# EAGLE design vcf (EAGLE 7.5.0)
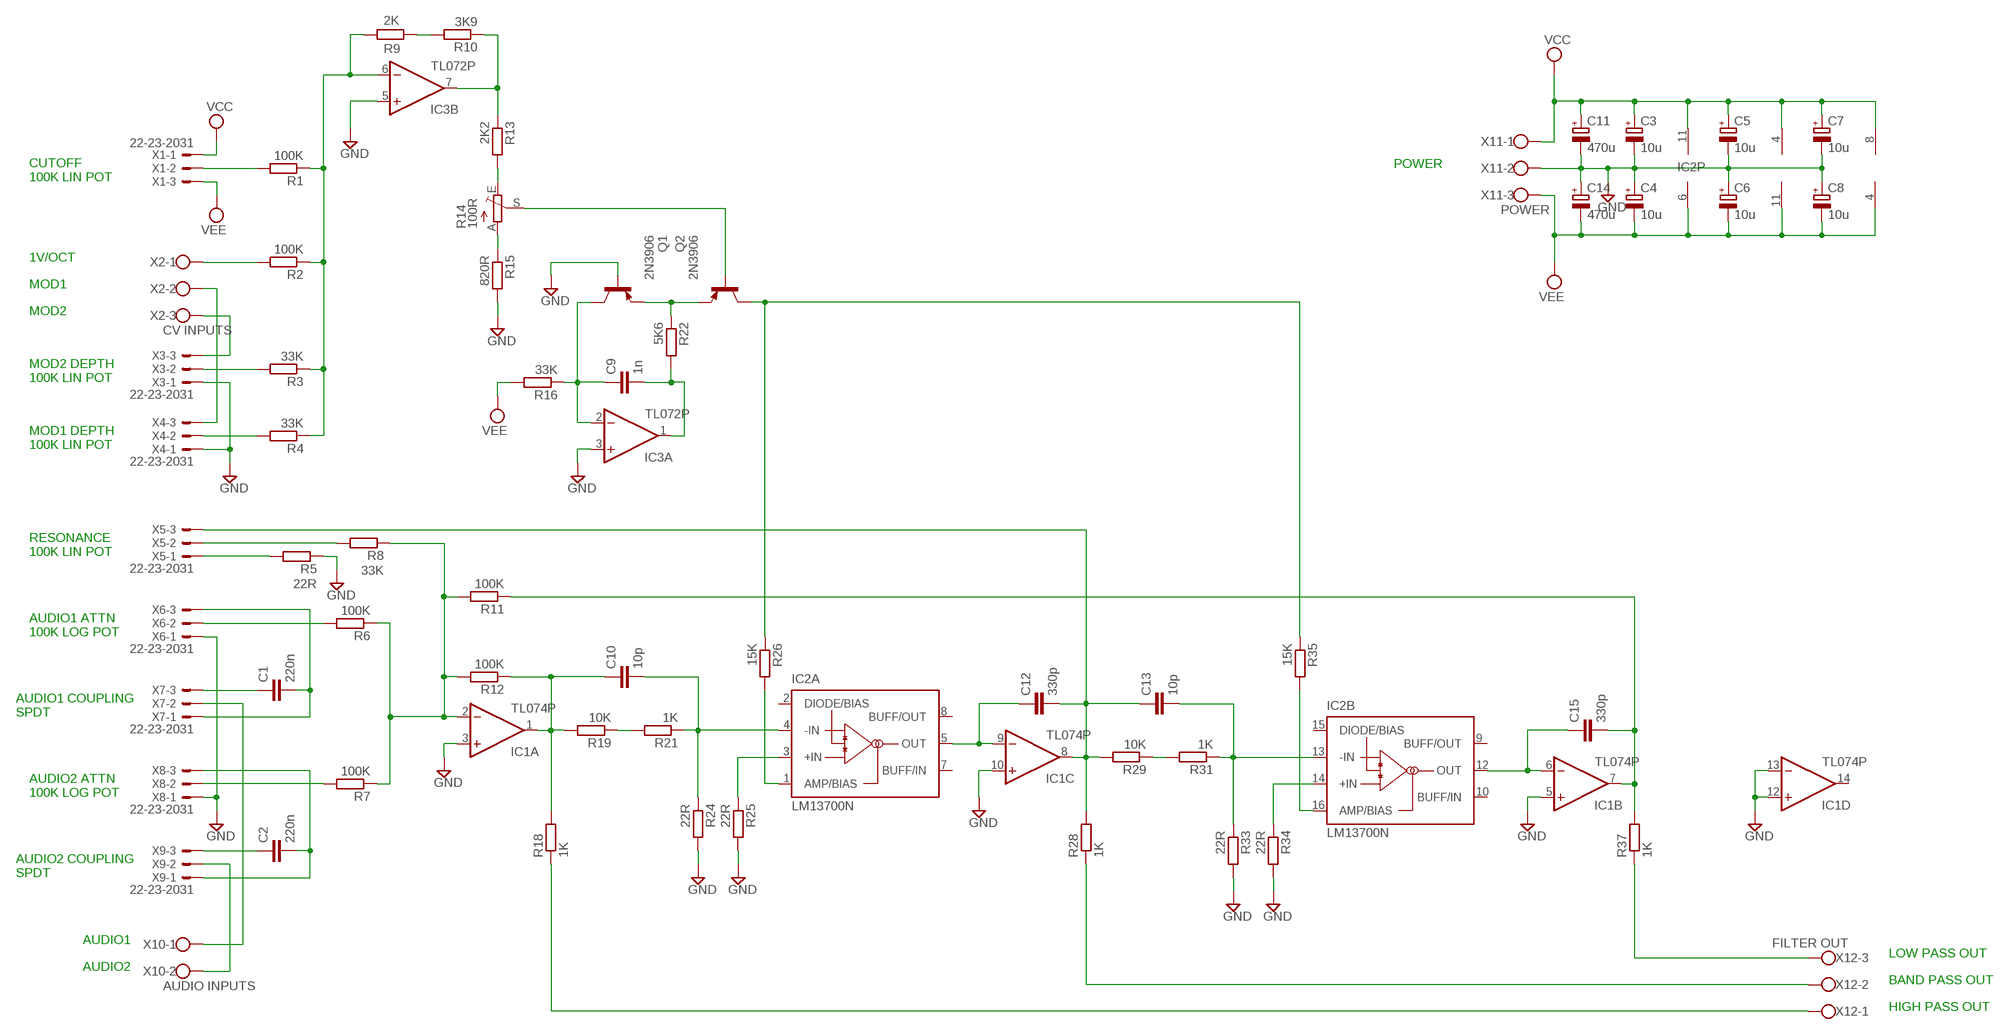
[diagram p0: schematic, sheet 1]

## Parts
C1  220n  C-EU025-025X050  [C025-025X050]
C2  220n  C-EU025-025X050  [C025-025X050]
C3  10u  CPOL-EUE1.8-4  [E1,8-4]
C4  10u  CPOL-EUE1.8-4  [E1,8-4]
C5  10u  CPOL-EUE1.8-4  [E1,8-4]
C6  10u  CPOL-EUE1.8-4  [E1,8-4]
C7  10u  CPOL-EUE1.8-4  [E1,8-4]
C8  10u  CPOL-EUE1.8-4  [E1,8-4]
C9  1n  C-EU025-024X044  [C025-024X044]
C10  10p  C-EU025-024X044  [C025-024X044]
C11  470u  CPOL-EUE2.5-6  [E2,5-6]
C12  330p  C-EU025-024X044  [C025-024X044]
C13  10p  C-EU025-024X044  [C025-024X044]
C14  470u  CPOL-EUE2.5-6  [E2,5-6]
C15  330p  C-EU025-024X044  [C025-024X044]
IC1  TL074P  [DIL14]
IC2  LM13700N  LM13600N  [DIL16]
IC3  TL072P  [DIL08]
Q1  2N3906  [TO92]
Q2  2N3906  [TO92]
R1  100K  R-EU_0204/7  [0204/7]
R2  100K  R-EU_0204/7  [0204/7]
R3  33K  R-EU_0204/7  [0204/7]
R4  33K  R-EU_0204/7  [0204/7]
R5  22R  R-EU_0204/7  [0204/7]
R6  100K  R-EU_0204/7  [0204/7]
R7  100K  R-EU_0204/7  [0204/7]
R8  33K  R-EU_0204/7  [0204/7]
R9  2K  R-EU_0309/12  [0309/12]
R10  3K9  R-EU_0204/7  [0204/7]
R11  100K  R-EU_0204/7  [0204/7]
R12  100K  R-EU_0204/7  [0204/7]
R13  2K2  R-EU_0204/7  [0204/7]
R14  100R  TRIM_EU-CA6V  [CA6V]
R15  820R  R-EU_0204/7  [0204/7]
R16  33K  R-EU_0204/7  [0204/7]
R18  1K  R-EU_0204/7  [0204/7]
R19  10K  R-EU_0204/7  [0204/7]
R21  1K  R-EU_0204/7  [0204/7]
R22  5K6  R-EU_0204/7  [0204/7]
R24  22R  R-EU_0204/7  [0204/7]
R25  22R  R-EU_0204/7  [0204/7]
R26  15K  R-EU_0204/7  [0204/7]
R28  1K  R-EU_0204/7  [0204/7]
R29  10K  R-EU_0204/7  [0204/7]
R31  1K  R-EU_0204/7  [0204/7]
R33  22R  R-EU_0204/7  [0204/7]
R34  22R  R-EU_0204/7  [0204/7]
R35  15K  R-EU_0204/7  [0204/7]
R37  1K  R-EU_0204/7  [0204/7]
X1  22-23-2031  [22-23-2031]
X2  CV INPUTS  W237-103  [W237-103]
X3  22-23-2031  [22-23-2031]
X4  22-23-2031  [22-23-2031]
X5  22-23-2031  [22-23-2031]
X6  22-23-2031  [22-23-2031]
X7  22-23-2031  [22-23-2031]
X8  22-23-2031  [22-23-2031]
X9  22-23-2031  [22-23-2031]
X10  AUDIO INPUTS  W237-102  [W237-102]
X11  POWER  W237-103  [W237-103]
X12  FILTER OUT  W237-103  [W237-103]

## Nets
GND: C3.- C4.+ C5.- C6.+ C7.- C8.+ C11.- C14.+ IC1.3(A:+IN) IC1.5(B:+IN) IC1.10(C:+IN) IC1.12(D:+IN) IC1.13(D:-IN) IC3.3(A:+IN) IC3.5(B:+IN) Q1.2(B) R5.1 R15.2 R24.2 R25.2 R33.2 R34.2 X3.1 X4.1 X6.1 X8.1 X11.2
N$1: X7.2 X10.1
N$1V-OCT: R2.2 X2.1
N$2: X2.3 X3.3
N$3: X2.2 X4.3
N$4: R3.2 X3.2
N$5: R4.2 X4.2
N$7: R1.2 X1.2
N$8: R9.2 R10.2
N$9: IC3.7(B:OUT) R10.1 R13.1
N$10: R13.2 R14.E
N$11: R14.A R15.1
N$12: Q1.3(E) Q2.3(E) R22.1
N$13: Q2.2(B) R14.S
N$14: C9.2 IC3.1(A:OUT) R22.2
N$15: C9.1 IC3.2(A:-IN) Q1.1(C) R16.1
N$16: X9.2 X10.2
N$17: C1.1 X7.3
N$18: C2.1 X9.3
N$19: C1.2 X6.3 X7.1
N$20: C2.2 X8.3 X9.1
N$21: R6.2 X6.2
N$22: R7.2 X8.2
N$23: C10.1 IC1.1(A:OUT) R12.1 R18.2 R19.2
N$24: R19.1 R21.2
N$25: C10.2 IC2.4(A:-IN) R21.1 R24.1
N$26: IC2.3(A:+IN) R25.1
N$27: IC2.1(A:AMP/BIAS) R26.2
N$28: IC1.2(A:-IN) R6.1 R7.1 R8.1 R11.2 R12.2
N$29: C12.1 IC1.9(C:-IN) IC2.5(A:OUT)
N$30: R29.1 R31.2
N$32: C13.2 IC2.13(B:-IN) R31.1 R33.1
N$33: R5.2 X5.1
N$34: IC2.14(B:+IN) R34.1
N$35: IC2.16(B:AMP/BIAS) R35.2
N$36: Q2.1(C) R26.1 R35.1
N$37: C15.1 IC1.6(B:-IN) IC2.12(B:OUT)
N$38: R8.2 X5.2
N$39: C12.2 C13.1 IC1.8(C:OUT) R28.2 R29.2 X5.3
N$47: C15.2 IC1.7(B:OUT) R11.1 R37.2
N$BP-OUT: R28.1 X12.2
N$EXP-CV: IC3.6(B:-IN) R1.1 R2.1 R3.1 R4.1 R9.1
N$HP-OUT: R18.1 X12.1
N$LP-OUT: R37.1 X12.3
VCC: C3.+ C5.+ C7.+ C11.+ IC1.4(P:V+) IC2.11(P:V+) IC3.8(P:V+) X1.1 X11.1
VEE: C4.- C6.- C8.- C14.- IC1.11(P:V-) IC2.6(P:V-) IC3.4(P:V-) R16.2 X1.3 X11.3
Unconnected: IC1.14(D:OUT) IC2.2(A:DIODE/BIAS) IC2.7(A:BUFF/IN) IC2.8(A:BUFF/OUT) IC2.9(B:BUFF/OUT) IC2.10(B:BUFF/IN) IC2.15(B:DIODE/BIAS)

## Notes on the sheet
- POWER
- CUTOFF
  100K LIN POT
- 1V/OCT
- MOD1
- MOD2
- MOD2 DEPTH
  100K LIN POT
- MOD1 DEPTH
  100K LIN POT
- RESONANCE
  100K LIN POT
- AUDIO1 ATTN
  100K LOG POT
- AUDIO1 COUPLING
  SPDT
- AUDIO2 ATTN
  100K LOG POT
- AUDIO2 COUPLING
  SPDT
- AUDIO1
- LOW PASS OUT
- AUDIO2
- BAND PASS OUT
- HIGH PASS OUT

## Library data of the parts
C1 C2 C9 C10 C12 C13 C15 = rcl:C-EU: CAPACITOR, European symbol
C3-C8 C11 C14 = rcl:CPOL-EU: POLARIZED CAPACITOR, European symbol
IC1 = linear:TL074: OP AMP
IC2 = national-semiconductor:LM13600: Dual Operational Transconductance Amplifiers with Linearizing Diodes and Buffers Source: lm13600.PDF
IC3 = linear:TL072: OP AMP
Q1 Q2 = transistor-pnp:2N3906: PNP Transistor
R1-R13 R15 R16 R18 R19 R21 R22 R24-R26 R28 R29 R31 R33-R35 R37 = rcl:R-EU_: RESISTOR, European symbol
R14 = pot:TRIM_EU-: POTENTIOMETER
X1 X3-X9 = con-molex:22-23-2031: .100" (2.54mm) Center Header - 3 Pin; MF: MOLEX; MPN: 22-23-2031; OC_FARNELL: 1462950; OC_NEWARK: 30C0862
X2 X11 X12 = con-wago-500:W237-103: WAGO SCREW CLAMP; MPN: 237-103; OC_FARNELL: unknown; OC_NEWARK: 18M7116
X10 = con-wago-500:W237-102: WAGO SCREW CLAMP; MPN: 237-102; OC_FARNELL: unknown; OC_NEWARK: 70K9898

## Board
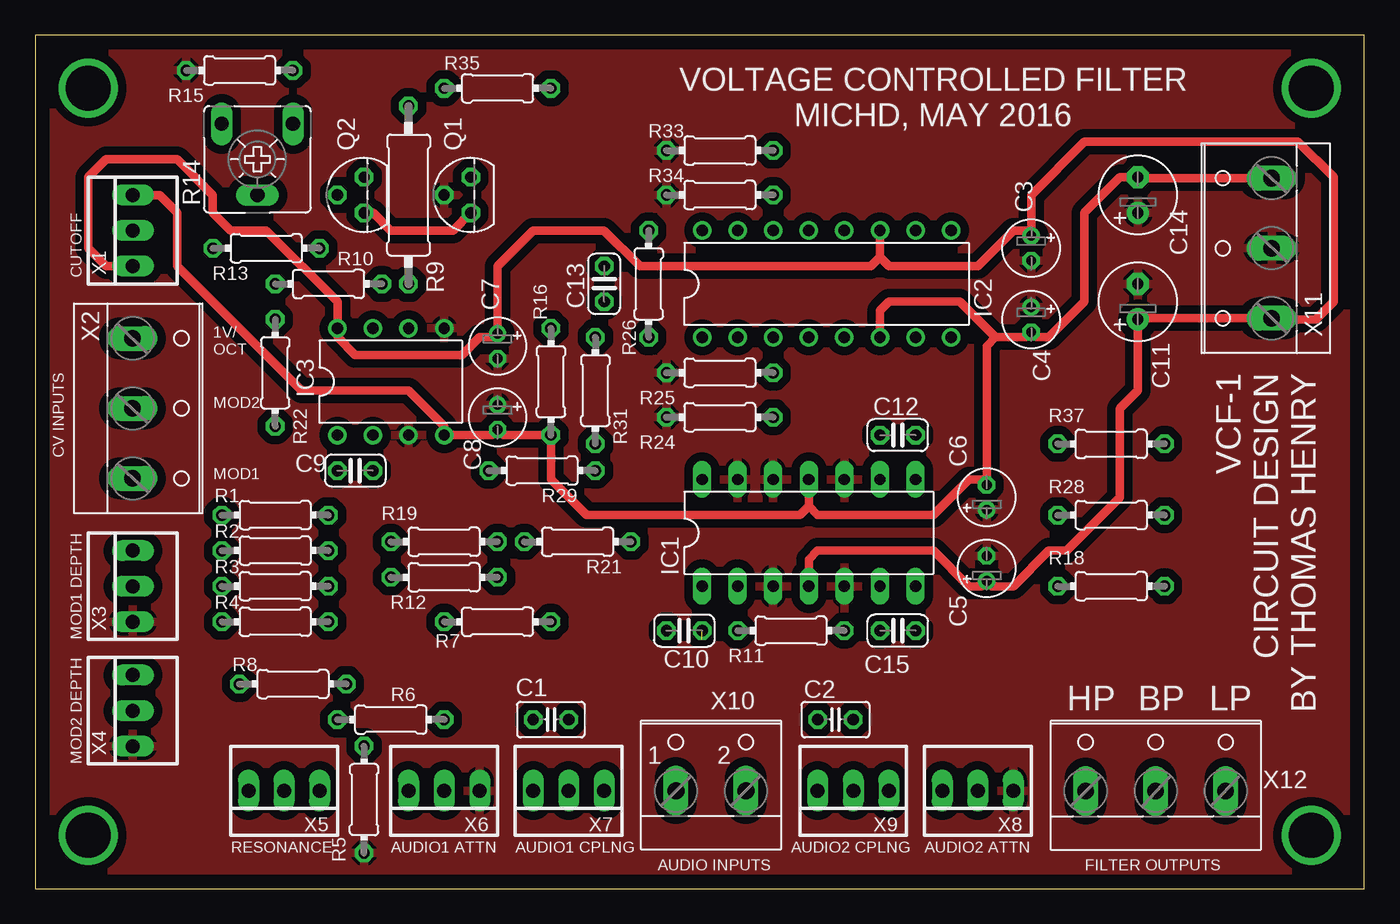
[diagram p1: board, top side]
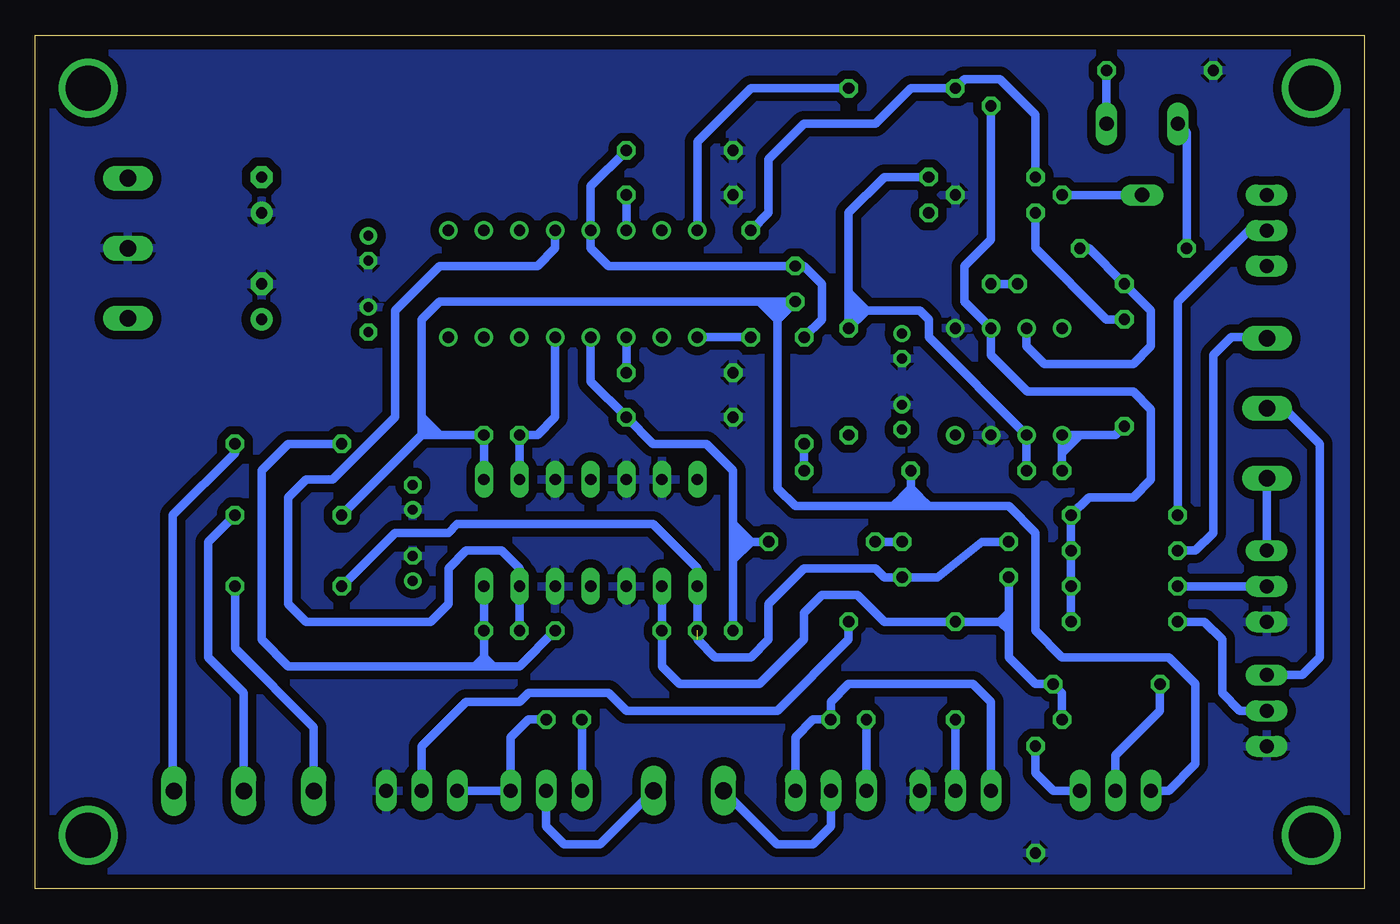
[diagram p2: board, bottom side, seen from below]

Size 94.92 x 60.95 mm. Coordinates in mm from the lower left corner, seen from the top.
Outline: 0,0 94.92,0 94.92,60.95 0,60.95 0,0
Copper layers (1*16): Top 0.035mm / dielectric 1.5mm / Bottom 0.035mm
Design rules "default": minimum track width 10mil, minimum drill 24mil, track to track 8mil, track to pad 8mil, pad to pad 8mil, via to via 8mil, smd to smd 8mil, copper to edge 40mil, drill to drill 8mil, minimum pad ring 10mil, minimum via ring 8mil, stop-mask expansion 4mil, vias tented up to drill 0mil, thermal gap 10mil

### Footprints (pad centres in the part's own frame; a part is rotated, then mirrored left to right if it is on the bottom)
C025-025X050 = drill 0.813 octagon: 1 -1.27,0; 2 1.27,0
E1,8-4 = drill 0.711 pad 1.168: + -0.889,0 | drill 0.711 pad 1.168 octagon: - 0.889,0
C025-024X044 = drill 0.813 octagon: 1 -1.27,0; 2 1.27,0
E2,5-6 = drill 0.813 pad 1.6: + -1.27,0 | drill 0.813 pad 1.6 octagon: - 1.27,0
DIL14 = drill 0.813 long: 1 -7.62,-3.81; 2 -5.08,-3.81; 3 -2.54,-3.81; 4 0,-3.81; 5 2.54,-3.81; 6 5.08,-3.81; 7 7.62,-3.81; 8 7.62,3.81; 9 5.08,3.81; 10 2.54,3.81; 11 0,3.81; 12 -2.54,3.81; 13 -5.08,3.81; 14 -7.62,3.81
DIL16 = drill 0.813 pad 1.27: 1 -8.89,-3.81; 2 -6.35,-3.81; 3 -3.81,-3.81; 4 -1.27,-3.81; 5 1.27,-3.81; 6 3.81,-3.81; 7 6.35,-3.81; 8 8.89,-3.81; 9 8.89,3.81; 10 6.35,3.81; 11 3.81,3.81; 12 1.27,3.81; 13 -1.27,3.81; 14 -3.81,3.81; 15 -6.35,3.81; 16 -8.89,3.81
DIL08 = drill 0.813 pad 1.27: 1 -3.81,-3.81; 2 -1.27,-3.81; 3 1.27,-3.81; 4 3.81,-3.81; 5 3.81,3.81; 6 1.27,3.81; 7 -1.27,3.81; 8 -3.81,3.81
TO92 = drill 0.813 octagon: 1 1.27,0; 2 0,1.905; 3 -1.27,0
0204/7 = drill 0.813 octagon: 1 -3.81,0; 2 3.81,0
0309/12 = drill 0.813 octagon: 1 -6.35,0; 2 6.35,0
CA6V = drill 1.016 long: A -2.54,-2.54; E 2.54,-2.54; S 0,2.54
22-23-2031 = drill 1 long: 1 -2.54,0; 2 0,0; 3 2.54,0
W237-103 = drill 1.194 long: 1 -5,-1.29; 2 0,-1.29; 3 5,-1.29
W237-102 = drill 1.194 long: 1 -2.5,-1.27; 2 2.5,-1.27

### Placement (x,y rotation side)
C1  36.83,12.06 0 top
C2  57.15,12.06 0 top
C3  71.12,45.72 270 top
C4  71.12,40.64 270 top
C5  67.94,22.86 90 top
C6  67.94,27.94 90 top
C7  33.02,38.73 270 top
C8  33.02,33.66 270 top
C9  22.86,29.84 180 top
C10  46.35,18.41 180 top
C11  78.74,41.91 90 top
C12  61.59,32.38 0 top
C13  40.64,43.18 90 top
C14  78.74,49.53 90 top
C15  61.59,18.41 0 top
IC1  55.24,25.4 0 top
IC2  56.52,43.18 0 top
IC3  25.4,36.2 0 top
Q1  31.11,49.53 90 top
Q2  23.5,49.53 90 top
R1  17.14,26.67 180 top
R2  17.14,24.13 180 top
R3  17.14,21.59 180 top
R4  17.14,19.05 180 top
R5  23.5,6.35 90 top
R6  25.4,12.06 0 top
R7  33.02,19.05 0 top
R8  18.41,14.61 180 top
R9  26.67,49.53 270 top
R10  20.95,43.18 0 top
R11  53.98,18.41 180 top
R12  29.21,22.23 180 top
R13  16.51,45.72 180 top
R14  15.88,52.07 180 top
R15  14.61,58.42 180 top
R16  36.83,36.2 270 top
R18  76.83,21.59 180 top
R19  29.21,24.77 180 top
R21  38.73,24.77 180 top
R22  17.14,36.83 270 top
R24  48.9,33.66 180 top
R25  48.9,36.83 180 top
R26  43.81,43.18 270 top
R28  76.83,26.67 180 top
R29  36.2,29.84 180 top
R31  40.01,35.56 270 top
R33  48.9,52.7 180 top
R34  48.9,49.53 180 top
R35  33.02,57.15 0 top
R37  76.83,31.75 180 top
X1  6.99,46.99 90 top
X2  8.26,34.29 270 top
X3  6.99,21.59 90 top
X4  6.99,12.7 90 top
X5  17.78,6.99 180 top
X6  29.21,6.99 180 top
X7  38.1,6.99 180 top
X8  67.31,6.99 180 top
X9  58.42,6.99 180 top
X10  48.26,8.26 0 top
X11  87,45.72 90 top
X12  80.01,8.26 0 top

### Tracks (layer width: path | path; a pad name or v marks a point on that pad's centre or on a via)
GND
  pour Top (isolate 0.61): 0.64,60.33 94.61,60.33 94.61,0.64 0.64,0.64
  pour Bottom (isolate 0.61): 0.64,60.33 94.61,60.33 94.61,0.64 0.64,0.64
N$1
  Bottom 0.61: X7.2 38.1,4.45 39.37,3.17 41.95,3.17 X10.1
N$1V-OCT
  Bottom 0.61: R2.2 12.06,24.13 10.79,25.4 10.79,38.1 9.53,39.37 7.04,39.37 X2.1
N$2
  Bottom 0.61: X3.3 6.99,28 X2.3
N$3
  Bottom 0.61: X2.2 5.71,34.29 3.17,31.75 3.17,16.51 4.45,15.24 X4.3
N$4
  Bottom 0.61: R3.2 X3.2
N$5
  Bottom 0.61: X4.2 8.89,12.7 10.16,13.97 10.16,17.78 11.43,19.05 R4.2
N$6  (via drill 3.2 pad 3.81)
  other vias: 3.81,3.81
N$7
  Bottom 0.61: R1.2 13.34,41.91 8.26,46.99 X1.2
N$8
  Bottom 0.61: R9.2 R10.2
N$9
  Bottom 0.61: IC3.7 24.13,38.73 22.86,37.47 16.51,37.47 15.24,38.73 15.24,41.27 R10.1 19.68,45.72 R13.1
N$10
  Bottom 0.61: R13.2 12.7,53.98 R14.E
N$11
  Bottom 0.61: R15.1 R14.A
N$12
  Top 0.61: Q2.3 24.13,48.26 25.4,46.99 29.84,46.99 Q1.3
  Bottom 0.61: Q2.3 23.5,45.72 18.41,40.64 R22.1
N$13
  Bottom 0.61: R14.S Q2.2
N$14
  Bottom 0.61: 21.59,31.75 IC3.1 20.95,32.38 | 21.59,31.11 C9.2 | R22.2 17.78,32.38 20.32,32.38 | 20.32,32.38 20.95,32.38 | 20.95,32.38 21.59,31.75 | 21.59,31.75 21.59,31.11 | 21.59,31.11 20.32,32.38
N$15
  Bottom 0.61: C9.1 IC3.2 31.11,39.37 31.11,40.64 31.75,41.27 35.56,41.27 | 35.56,41.27 36.2,40.64 | 36.2,40.64 R16.1 36.83,41.27 | Q1.1 34.29,50.8 36.83,48.26 36.83,42.55 | 36.2,41.91 36.83,42.55 | 36.83,42.55 36.83,41.27 | 36.83,41.27 35.56,41.27 | 35.56,41.27 36.2,41.91 | 36.2,41.91 36.83,41.27 | 36.83,41.27 36.2,40.64
N$16
  Bottom 0.61: X9.2 58.42,4.45 57.15,3.17 54.57,3.17 X10.2
N$17
  Bottom 0.61: X7.3 C1.1
N$18
  Bottom 0.61: C2.1 X9.3
N$19
  Bottom 0.61: X7.1 40.64,10.79 39.37,12.06 C1.2 38.1,13.34 36.83,14.61 27.94,14.61 26.67,13.34 X6.3
N$20
  Bottom 0.61: C2.2 59.69,12.06 60.96,10.79 X9.1 X8.3
N$21
  Bottom 0.61: R6.2 X6.2
N$22
  Bottom 0.61: X8.2 67.31,10.16 64.14,13.34 60.33,13.34 59.69,13.97 53.98,13.97 52.7,12.7 41.91,12.7 36.83,17.78 R7.2
N$23  (1 unrouted)
  Bottom 0.61: R18.2 69.22,25.4 65.41,25.4 64.77,26.04 50.8,26.04 47.62,22.86 IC1.1 47.62,17.78 46.35,16.51 43.81,16.51 42.55,17.78 42.55,20.32 40.01,22.86 34.92,22.86 34.29,22.23 R12.1 30.48,22.23 27.3,24.77 R19.2
N$24
  Bottom 0.61: R21.2 R19.1
N$25
  Bottom 0.61: C10.2 45.09,23.5 | 45.09,24.13 45.09,25.4 | 45.09,25.4 45.09,26.04 | 45.09,26.04 45.09,29.84 46.99,31.75 50.8,31.75 R24.1 55.24,36.2 IC2.4 | R21.1 43.81,24.77 | 43.81,24.77 44.45,24.77 | 44.45,24.77 45.09,25.4 | 44.45,24.77 45.09,24.13 | 45.09,24.13 45.09,23.5 | 45.09,23.5 43.81,24.77 | 43.81,24.77 45.09,26.04
N$26
  Bottom 0.61: IC2.3 R25.1
N$27
  Bottom 0.61: IC2.1 R26.2
N$28
  Bottom 0.61: IC1.2 R11.2 50.16,15.88 48.9,14.61 43.18,14.61 40.01,17.78 40.01,19.68 38.73,20.95 36.2,20.95 34.29,19.05 R7.1 26.04,19.05 | 25.4,18.41 25.4,16.51 23.5,14.61 R8.1 21.59,13.97 R6.1 | 25.4,18.41 25.4,19.05 | 25.4,19.05 25.4,19.68 | 25.4,19.68 R12.2 | 26.04,19.05 25.4,19.05 | 25.4,19.68 26.04,19.05 | 26.04,19.05 25.4,18.41
N$29
  Bottom 0.61: IC1.9 C12.1 59.05,32.38 57.78,33.66 IC2.5
N$30
  Bottom 0.61: R29.1 R31.2
N$31  (via drill 3.2 pad 3.81)
  other vias: 3.81,57.14
N$32
  Bottom 0.61: R31.1 38.73,40.64 38.73,43.18 40.01,44.45 C13.2 53.98,44.45 55.24,45.72 IC2.13 55.24,50.16 R33.1
N$33
  Bottom 0.61: X5.1 22.23,6.99 23.5,8.26 R5.2
N$34
  Bottom 0.61: R34.1 IC2.14
N$35
  Bottom 0.61: R35.2 43.81,57.15 47.62,53.34 IC2.16
N$36
  Bottom 0.61: Q2.1 23.5,55.24 26.04,57.78 28.57,57.78 R35.1 32.38,57.15 34.92,54.61 40.01,54.61 42.55,52.07 42.55,48.26 R26.1
N$37
  Bottom 0.61: C15.1 IC1.6 60.33,22.86 61.59,24.13 64.14,24.13 65.41,22.86 65.41,20.32 66.67,19.05 75.56,19.05 76.83,20.32 76.83,27.94 75.56,29.21 73.66,29.21 69.22,33.66 69.22,41.27 66.04,44.45 59.05,44.45 57.78,45.72 IC2.12
N$38
  Bottom 0.61: X5.2 17.78,9.53 14.61,12.7 R8.2
N$39
  Bottom 0.61: IC1.8 C12.2 66.04,32.38 | 31.11,27.3 25.4,27.3 23.5,25.4 23.5,18.41 21.59,16.51 13.97,16.51 12.06,14.61 12.06,8.89 13.97,6.99 X5.3 | 31.11,27.3 31.75,27.3 | 31.75,27.3 32.38,27.3 | 32.38,27.3 33.02,27.3 | 33.66,27.3 40.64,27.3 41.91,28.57 41.91,40.64 | 43.18,41.91 66.04,41.91 67.31,40.64 67.31,33.66 | 67.31,33.66 66.67,33.02 | 66.67,33.02 66.04,32.38 | R28.2 67.31,32.38 | 67.31,32.38 66.04,32.38 | 66.67,33.02 67.31,32.38 | 67.31,33.66 67.31,32.38 | 41.91,40.64 41.27,41.27 | 41.27,41.27 C13.1 41.91,41.91 | 41.91,41.91 43.18,41.91 | 43.18,41.91 42.55,41.27 | 42.55,41.27 41.91,40.64 | 41.91,40.64 41.91,41.91 | 42.55,41.27 41.91,41.91 | 41.91,41.91 41.27,41.27 | R29.2 32.38,28.57 | 32.38,28.57 32.38,27.3 | 31.11,27.3 31.75,27.94 | 31.75,27.94 32.38,28.57 | 32.38,28.57 33.02,27.94 | 33.02,27.94 33.66,27.3 | 33.66,27.3 33.02,27.3 | 33.02,27.3 33.02,27.94 | 33.02,27.94 31.75,27.94 | 31.75,27.94 31.75,27.3
N$40  (via drill 3.2 pad 3.81)
  other vias: 91.11,57.14
N$41  (via drill 3.2 pad 3.81)
  other vias: 91.11,3.81
N$47
  Bottom 0.61: R11.1 60.33,15.88 62.23,15.88 | 62.23,15.88 62.87,15.88 | 62.87,15.88 63.5,15.88 | 63.5,15.88 76.83,15.88 78.74,17.78 78.74,29.84 76.83,31.75 R37.2 | C15.2 IC1.7 62.87,16.51 | 62.87,16.51 62.87,15.88 | 62.23,15.88 62.87,16.51 | 62.87,16.51 63.5,15.88
N$BP-OUT
  Bottom 0.61: R28.1 82.55,24.77 82.55,16.51 80.01,13.97 X12.2
N$EXP-CV
  Bottom 0.61: R4.1 R3.1 R2.1 R1.1 19.68,27.94 16.51,27.94 15.24,29.21 15.24,34.22 16.5,35.48 24.05,35.48 26.67,38.1 IC3.6 28.57,41.91 28.57,44.45 26.67,46.35 R9.1
N$HP-OUT
  Bottom 0.61: X12.1 75.01,11.51 80.64,17.14 R18.1
N$LP-OUT
  Bottom 0.61: R37.1 80.64,31.11 85.09,26.67 85.09,7.04 X12.3
VCC
  Top 0.61: IC1.4 55.24,23.5 55.88,24.13 64.14,24.13 66.67,21.59 67.56,21.59 C5.+ 68.33,21.59 69.85,21.59 72.39,24.13 73.66,24.13 77.47,27.94 77.47,34.29 78.74,35.56 C11.+ 78.82,40.72 X11.1 88.36,40.64 91.44,40.64 92.71,41.91 92.71,50.8 90.17,53.34 74.93,53.34 71.12,49.53 C3.+ 70.74,46.99 69.85,46.99 67.31,44.45 60.96,44.45 60.33,45.09 | C7.+ 32.77,39.37 31.75,39.37 30.48,38.1 22.86,38.1 21.59,39.37 IC3.8 21.59,41.91 16.51,46.99 13.97,46.99 12.7,48.26 12.7,49.53 10.16,52.07 5.08,52.07 3.81,50.8 3.81,45.72 5.08,44.45 X1.1 | C7.+ 33.02,39.37 | C7.+ 33.02,44.45 35.56,46.99 40.64,46.99 43.18,44.45 59.69,44.45 60.33,45.09 | IC2.11 60.33,45.09
VEE
  Top 0.61: X11.3 78.82,50.72 C14.- 77.47,50.8 74.93,48.26 74.93,41.91 72.39,39.37 71.5,39.37 C4.- 70.74,39.37 68.58,39.37 | IC2.6 60.33,41.27 60.96,41.91 66.04,41.91 68.58,39.37 | 68.58,39.37 67.94,38.73 C6.- 67.56,29.21 66.67,29.21 64.14,26.67 55.88,26.67 55.24,27.3 | IC1.11 55.24,27.3 | 55.24,27.3 54.61,26.67 39.37,26.67 36.83,29.21 R16.2 33.4,32.38 C8.- 32.64,32.38 IC3.4 29.21,33.02 26.67,35.56 19.05,35.56 10.16,44.45 10.16,48.26 8.89,49.53 X1.3

### Text on the board
tNames: VOLTAGE CONTROLLED FILTER / MICHD, MAY 2016 | CUTOFF | 1V/ / OCT | CV INPUTS | VCF-1 / CIRCUIT DESIGN / BY THOMAS HENRY | MOD2 | MOD1 | MOD1 DEPTH | MOD2 DEPTH | HP | BP | LP | RESONANCE | AUDIO1 ATTN | AUDIO1 CPLNG | AUDIO2 CPLNG | AUDIO2 ATTN | AUDIO INPUTS | FILTER OUTPUTS